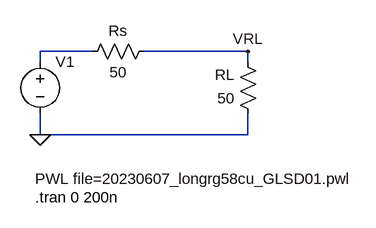
[diagram p0: schematic pwl_test.asc]
pwl_test.asc, the LTspice schematic file:
Version 4
SHEET 1 1272 680
WIRE 16 144 -64 144
WIRE 256 144 96 144
WIRE -64 160 -64 144
WIRE 256 160 256 144
WIRE -64 272 -64 240
WIRE 256 272 256 240
WIRE 256 272 -64 272
FLAG -64 272 0
FLAG 256 144 VRL
SYMBOL res 112 128 R90
WINDOW 0 0 56 VBottom 2
WINDOW 3 32 56 VTop 2
SYMATTR InstName Rs
SYMATTR Value 50
SYMBOL voltage -64 144 R0
WINDOW 123 0 0 Left 0
WINDOW 39 0 0 Left 0
WINDOW 3 -8 196 Left 2
SYMATTR Value PWL file=20230607_longrg58cu_GLSD01.pwl
SYMATTR InstName V1
SYMBOL res 272 256 R180
WINDOW 0 36 76 Left 2
WINDOW 3 36 40 Left 2
SYMATTR InstName RL
SYMATTR Value 50
TEXT -72 368 Left 2 !.tran 0 200n

The netlist it stands for:
* pwl_test.asc
Rs VRL N001 50
V1 N001 0 PWL file=20230607_longrg58cu_GLSD01.pwl
RL 0 VRL 50
.tran 0 200n
.backanno
.end